# EAGLE design Mother Board (EAGLE 9.6.2)
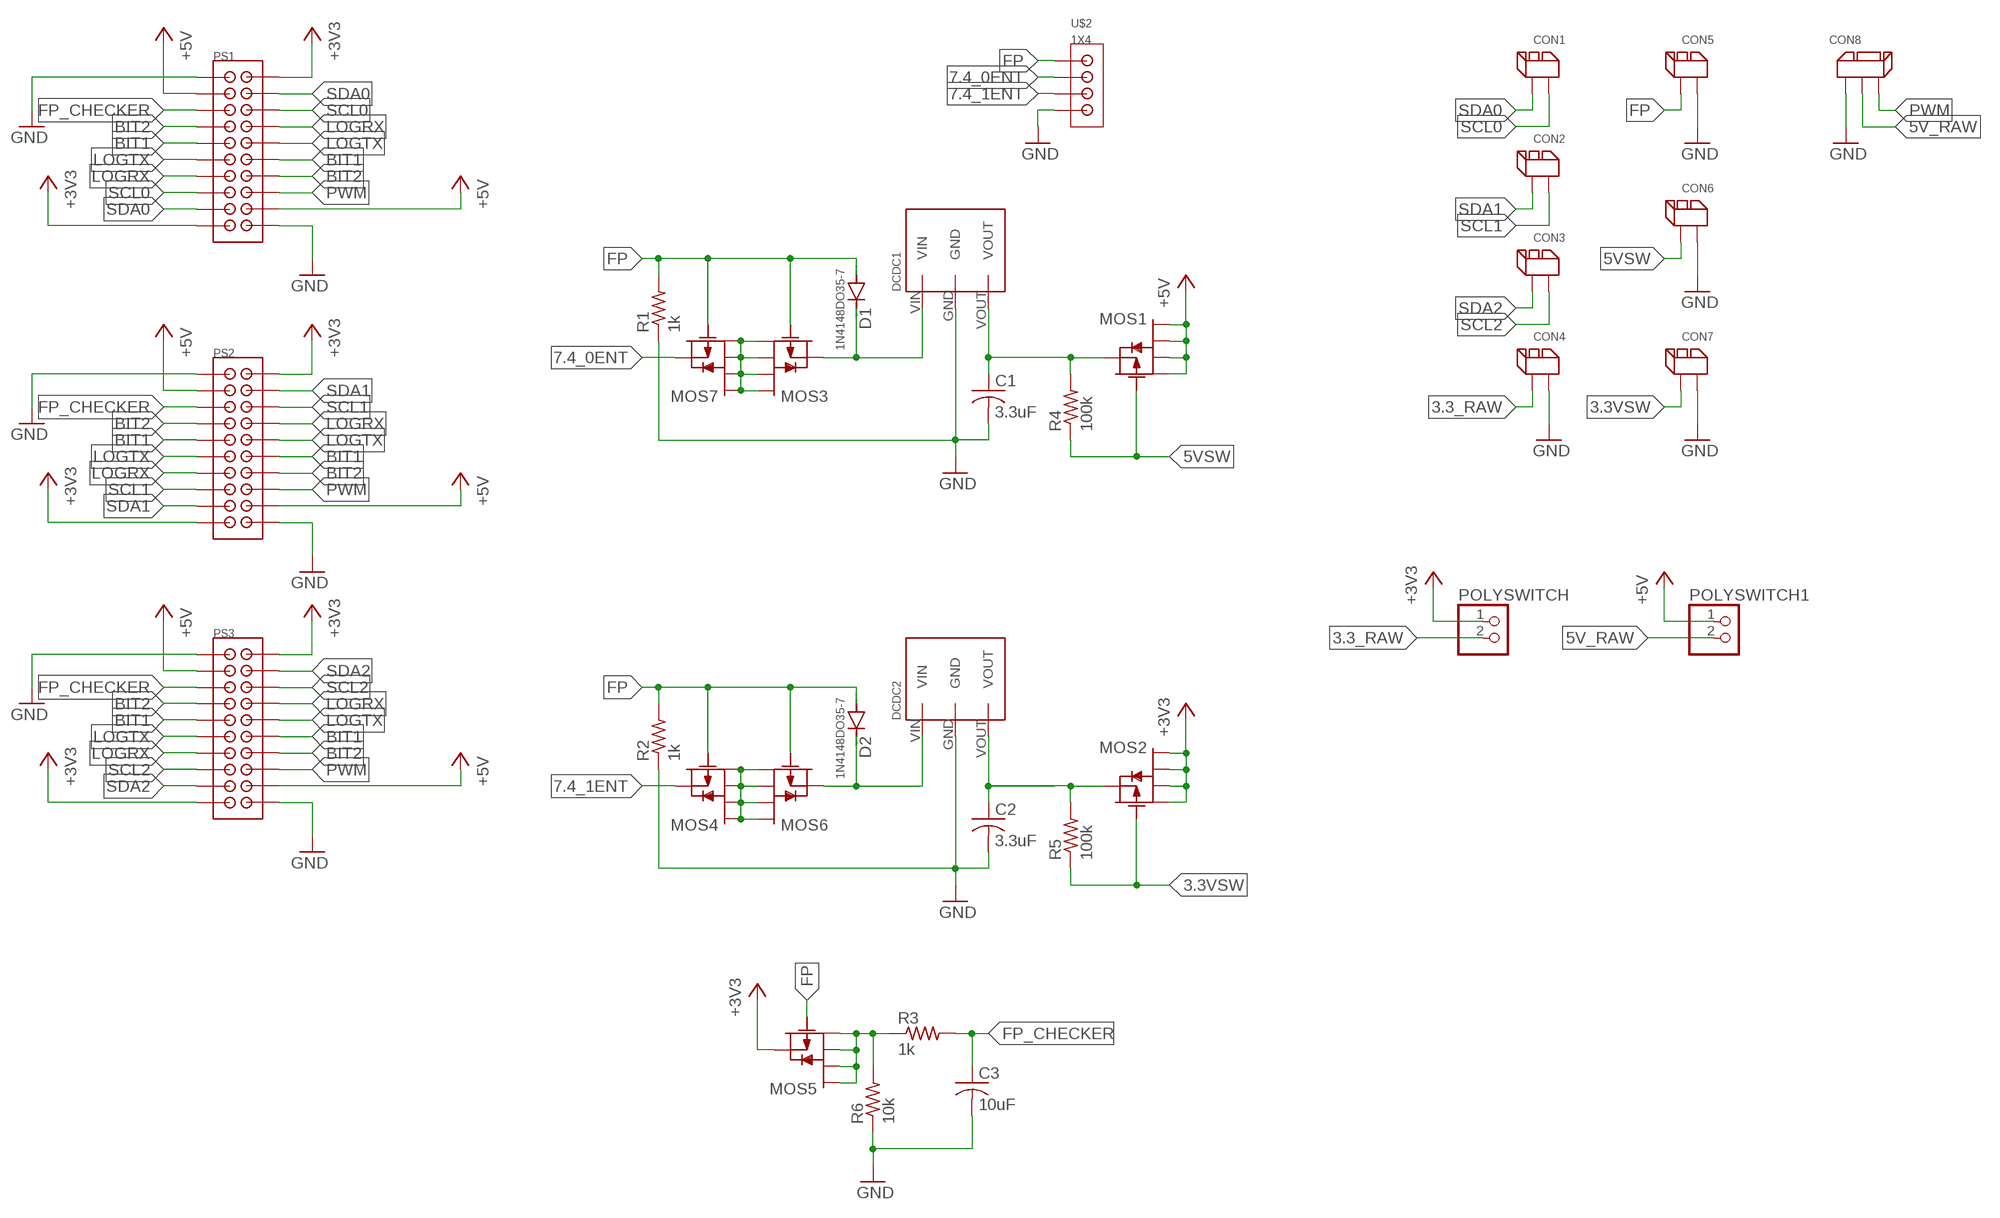
[diagram p0: schematic, sheet 1]

## Parts
C1  3.3uF  C-USC0603  [C0603]
C2  3.3uF  C-USC0603  [C0603]
C3  10uF  C-USC0603  [C0603]
CON1  2PIN  [2PIN]
CON2  2PIN  [2PIN]
CON3  2PIN  [2PIN]
CON4  2PIN  [2PIN]
CON5  2PIN  [2PIN]
CON6  2PIN  [2PIN]
CON7  2PIN  [2PIN]
CON8  3PIN  [3PIN]
D1  1N4148DO35-7  [DO35-7]
D2  1N4148DO35-7  [DO35-7]
DCDC1  5V1A_M78AR05-1  [5V1A_M78AR05-1]
DCDC2  3.3V1A_M78AR033-1  [3.3V1A_M78AR033-1]
MOS1  PCH_SSM6J808R  [SSM6J808R]
MOS2  PCH_SSM6J808R  [SSM6J808R]
MOS3  PCH_SSM6J808R  [SSM6J808R]
MOS4  PCH_SSM6J808R  [SSM6J808R]
MOS5  PCH_SSM6J808R  [SSM6J808R]
MOS6  PCH_SSM6J808R  [SSM6J808R]
MOS7  PCH_SSM6J808R  [SSM6J808R]
POLYSWITCH  PINHD-1X2  [1X02]
POLYSWITCH1  PINHD-1X2  [1X02]
PS1  2X10  [2X10]
PS2  2X10  [2X10]
PS3  2X10  [2X10]
R1  1k  R-US_R0603  [R0603]
R2  1k  R-US_R0603  [R0603]
R3  1k  R-US_R0603  [R0603]
R4  100k  R-US_R0603  [R0603]
R5  100k  R-US_R0603  [R0603]
R6  10k  R-US_R0603  [R0603]
U$2  1X4  [1X4]

## Nets
3.3_RAW: CON4.P$2 POLYSWITCH.2
3.3V_ENT: C2.1 DCDC2.VOUT
3.3VSW: CON7.P$2 MOS2.3 R5.1
5V_ENT: C1.1 DCDC1.VOUT MOS1.4 R4.2
5V_ENT1: MOS2.4 R5.2
5V_RAW: CON8.P$2 POLYSWITCH1.2
5VSW: CON6.P$2 MOS1.3 R4.1
7.4_0ENT: MOS7.4 U$2.P$2
7.4_1ENT: MOS4.4 U$2.P$3
+3V3: MOS2.1 MOS2.2 MOS2.5 MOS2.6 MOS5.4 POLYSWITCH.1 PS1.P$2 PS1.P$19 PS2.P$2 PS2.P$19 PS3.P$2 PS3.P$19
+5V: MOS1.1 MOS1.2 MOS1.5 MOS1.6 POLYSWITCH1.1 PS1.P$3 PS1.P$18 PS2.P$3 PS2.P$18 PS3.P$3 PS3.P$18
BIT1: PS1.P$9 PS1.P$12 PS2.P$9 PS2.P$12 PS3.P$9 PS3.P$12
BIT2: PS1.P$7 PS1.P$14 PS2.P$7 PS2.P$14 PS3.P$7 PS3.P$14
FP: CON5.P$2 D1.A D2.A MOS3.3 MOS4.3 MOS5.3 MOS6.3 MOS7.3 R1.2 R2.2 U$2.P$1
FP_CHECKER: C3.1 PS1.P$5 PS2.P$5 PS3.P$5 R3.2
GND: C1.2 C2.2 C3.2 CON4.P$1 CON5.P$1 CON6.P$1 CON7.P$1 CON8.P$1 DCDC1.GND DCDC2.GND PS1.P$1 PS1.P$20 PS2.P$1 PS2.P$20 PS3.P$1 PS3.P$20 R1.1 R2.1 R6.1 U$2.P$4
LOGRX: PS1.P$8 PS1.P$13 PS2.P$8 PS2.P$13 PS3.P$8 PS3.P$13
LOGTX: PS1.P$10 PS1.P$11 PS2.P$10 PS2.P$11 PS3.P$10 PS3.P$11
N$1: D2.C DCDC2.VIN MOS6.4
N$2: MOS4.1 MOS4.2 MOS4.5 MOS4.6 MOS6.1 MOS6.2 MOS6.5 MOS6.6
N$11: D1.C DCDC1.VIN MOS3.4
N$12: MOS3.1 MOS3.2 MOS3.5 MOS3.6 MOS7.1 MOS7.2 MOS7.5 MOS7.6
N$14: MOS5.1 MOS5.2 MOS5.5 MOS5.6 R3.1 R6.2
PWM: CON8.P$3 PS1.P$16 PS2.P$16 PS3.P$16
SCL0: CON1.P$1 PS1.P$6 PS1.P$15
SCL1: CON2.P$1 PS2.P$6 PS2.P$15
SCL2: CON3.P$1 PS3.P$6 PS3.P$15
SDA0: CON1.P$2 PS1.P$4 PS1.P$17
SDA1: CON2.P$2 PS2.P$4 PS2.P$17
SDA2: CON3.P$2 PS3.P$4 PS3.P$17

## Library data of the parts
C1-C3 = rcl:C-US: CAPACITOR, American symbol; SPICEPREFIX: C
CON1-CON7 = XR Connector:2PIN
CON8 = XR Connector:3PIN
D1 D2 = diode:1N4148: DIODE high speed (Philips)
DCDC1 = DC-DC:5V1A_M78AR05-1
DCDC2 = DC-DC:3.3V1A_M78AR033-1
MOS1-MOS7 = Chip MOSFET:PCH_SSM6J808R
POLYSWITCH POLYSWITCH1 = pinhead:PINHD-1X2: PIN HEADER
PS1-PS3 = PinSocket:2X10
R1-R6 = rcl:R-US_: RESISTOR, American symbol; SPICEPREFIX: R
U$2 = PinSocket:1X4

## Net classes
1 esp: width 0.254 mm, drill 0.127 mm, clearance 0.025 mm

## Board
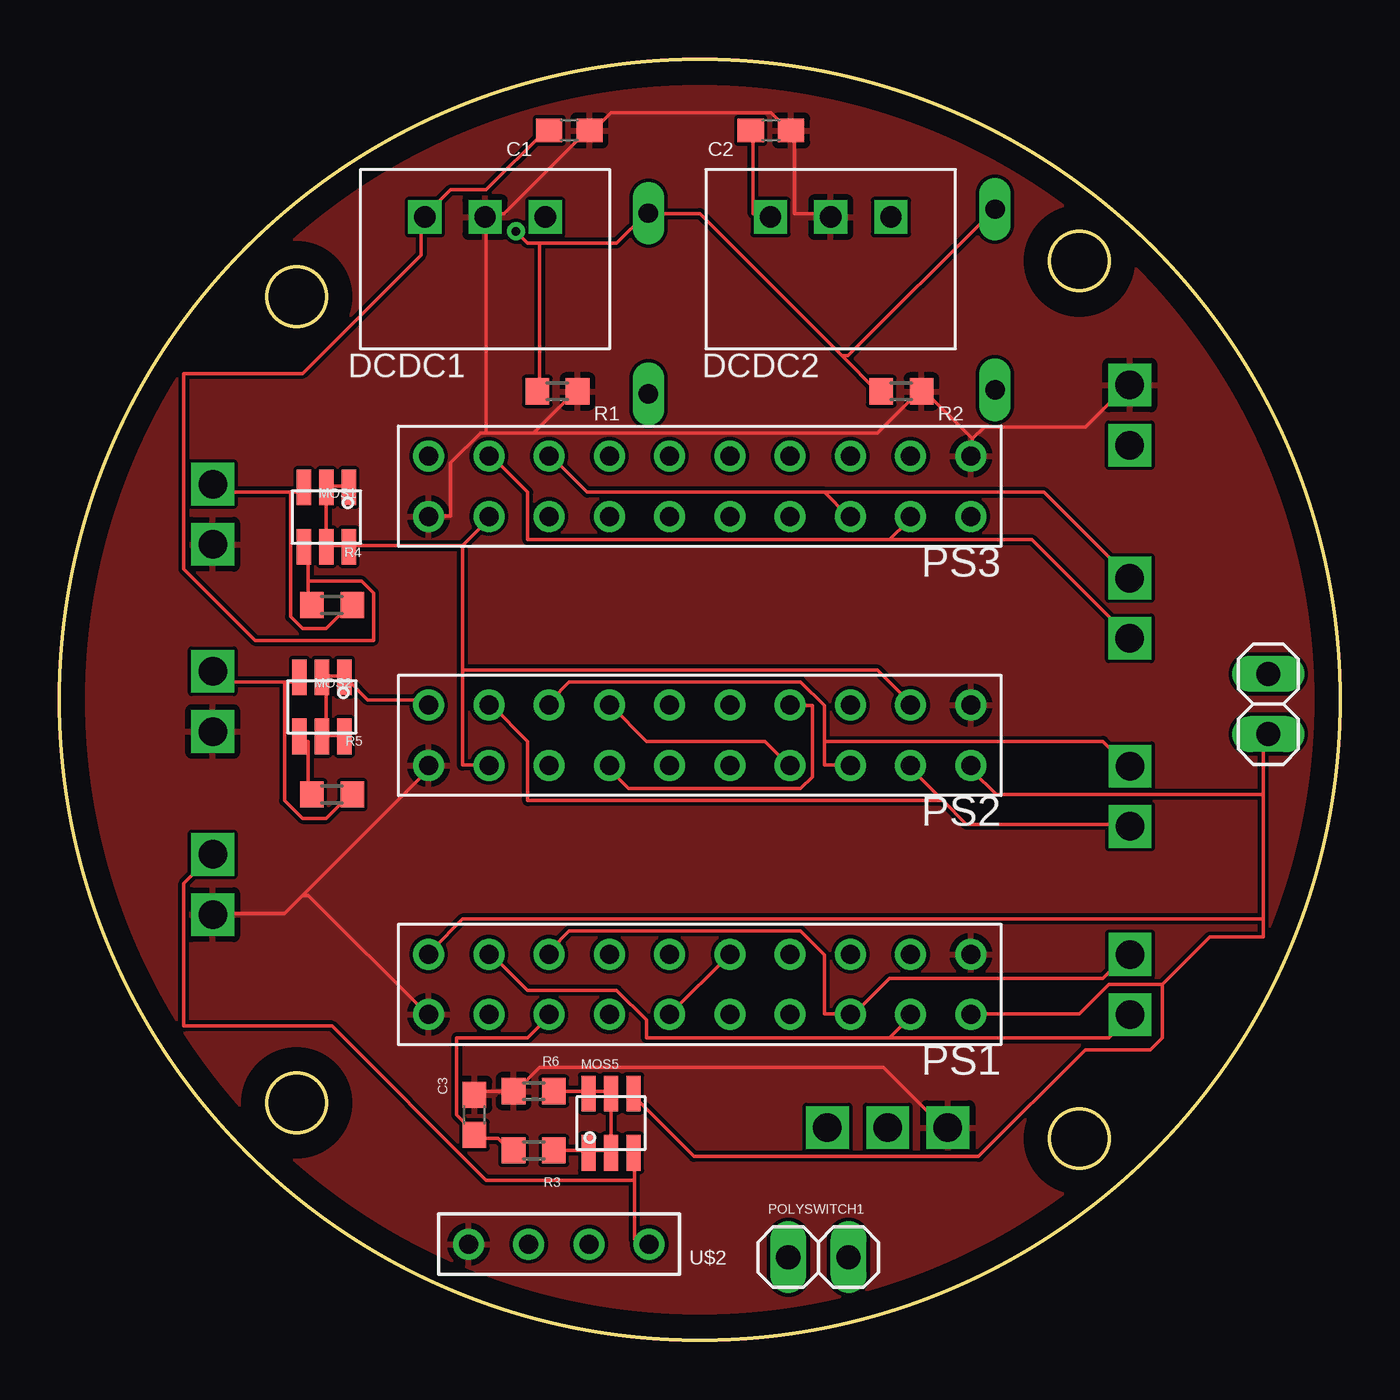
[diagram p1: board, top side]
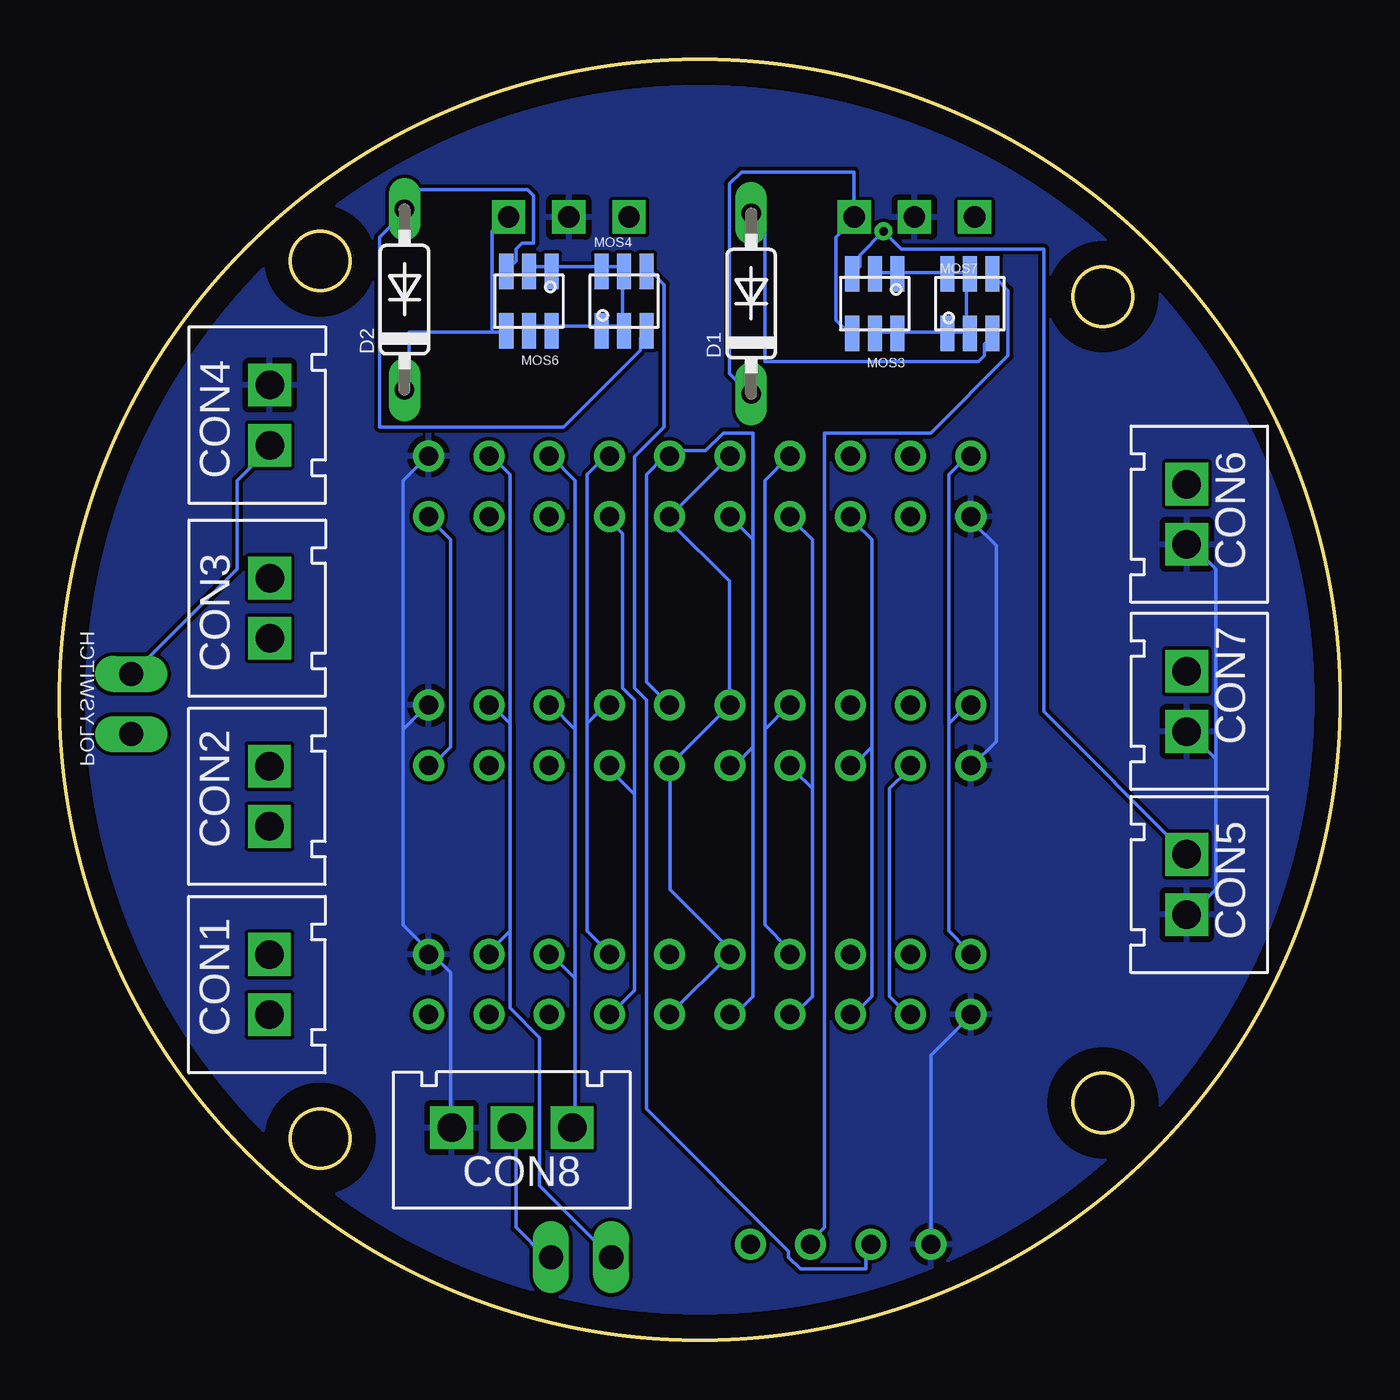
[diagram p2: board, bottom side, seen from below]

Size 54 x 54 mm. Coordinates in mm from the lower left corner, seen from the top.
Outline: circle at 27,27 radius 27
Outline: circle at 10,44 radius 1.25
Outline: circle at 10,10 radius 1.25
Outline: circle at 43,45.5 radius 1.25
Outline: circle at 43,8.5 radius 1.25
Copper layers (1*16): Top 0.035mm / dielectric 1.5mm / Bottom 0.035mm
Design rules "default": minimum track width 6mil, minimum drill 0.35mm, track to track 6mil, track to pad 6mil, pad to pad 6mil, via to via 6mil, smd to smd 6mil, copper to edge 40mil, drill to drill 6mil, minimum pad ring 10mil, minimum via ring 8mil, stop-mask expansion 4mil, vias tented up to drill 0mil, thermal gap 10mil

### Footprints (pad centres in the part's own frame; a part is rotated, then mirrored left to right if it is on the bottom)
C0603 = smd 1.1 x 1: 1 -0.85,0; 2 0.85,0
2PIN = drill 1.2 square: P$1 -1.27,0; P$2 1.27,0
3PIN = drill 1.2 square: P$1 2.54,-2.54; P$2 5.08,-2.54; P$3 7.62,-2.54
DO35-7 = drill 0.813 long: A 3.81,0; C -3.81,0
5V1A_M78AR05-1 = drill 0.9 pad 1.27 square: GND 0,0; VIN 2.54,0; VOUT -2.54,0
3.3V1A_M78AR033-1 = drill 0.9 pad 1.27 square: GND 0,0; VIN 2.54,0; VOUT -2.54,0
SSM6J808R = smd 0.6 x 1.5: 1 -0.95,-1.25; 2 0,-1.25; 3 0.95,-1.25; 4 0.95,1.25; 5 0,1.25; 6 -0.95,1.25
1X02 = drill 1.016 long: 1 -1.27,0; 2 1.27,0
2X10 = drill 0.8: P$1 0,1.27; P$2 0,-1.27; P$3 -2.54,1.27; P$4 -2.54,-1.27; P$5 -5.08,1.27; P$6 -5.08,-1.27; P$7 -7.62,1.27; P$8 -7.62,-1.27; P$9 -10.16,1.27; P$10 -10.16,-1.27; P$11 -12.7,1.27; P$12 -12.7,-1.27; P$13 -15.24,1.27; P$14 -15.24,-1.27; P$15 -17.78,1.27; P$16 -17.78,-1.27; P$17 -20.32,1.27; P$18 -20.32,-1.27; P$19 -22.86,1.27; P$20 -22.86,-1.27
R0603 = smd 1 x 1.1: 1 -0.85,0; 2 0.85,0
1X4 = drill 0.8: P$1 0,0; P$2 2.54,0; P$3 5.08,0; P$4 7.62,0

### Placement (x,y rotation side)
C1  21.5,51 0 top
C2  30,51 0 top
C3  17.5,9.5 90 top
CON1  45.14,14.99 270 bottom
CON2  45.14,22.93 270 bottom
CON3  45.13,30.86 270 bottom
CON4  45.13,39 270 bottom
CON5  6.47,19.21 90 bottom
CON6  6.47,34.82 90 bottom
CON7  6.47,26.93 90 bottom
CON8  40,11.5 0 bottom
D1  24.83,43.7 90 bottom
D2  39.45,43.87 90 bottom
DCDC1  17.95,47.35 0 top
DCDC2  32.52,47.35 0 top
MOS1  11.26,34.7 180 top
MOS2  11.07,26.7 180 top
MOS3  19.62,43.7 180 bottom
MOS4  30.19,43.8 0 bottom
MOS5  23.26,9.15 0 top
MOS6  34.2,43.8 180 bottom
MOS7  15.61,43.7 0 bottom
POLYSWITCH  50.97,26.82 90 top
POLYSWITCH1  32,3.5 0 top
PS1  15.57,15 180 top
PS2  15.57,25.5 180 top
PS3  15.57,36 180 top
R1  21,40 180 top
R2  35.5,40 180 top
R3  20,8 180 top
R4  11.5,31 180 top
R5  11.5,23 180 top
R6  20,10.5 0 top
U$2  24.87,4.05 180 top

### Tracks (layer width: path | path; a pad name or v marks a point on that pad's centre or on a via)
3.3_RAW
  Bottom 0.152: POLYSWITCH.2 50.75,28.25 46.5,32.5 46.5,36.25 45.25,37.5 CON4.P$2
3.3V_ENT
  Top 0.152: C2.1 29.25,51 29.25,47.5 29.75,47.5 DCDC2.VOUT
3.3VSW
  Top 0.152: 9.5,27.75 9.5,22.75 10.25,22 11.25,22 12.25,23 R5.1 | 9.5,27.75 10,27.75 MOS2.3 | 9.5,27.75 6.75,27.75 6.5,28 CON7.P$2
5V_ENT
  Top 0.152: 10.5,32 10.5,33.25 MOS1.4 | 10.5,32 10.5,31 R4.2 | C1.1 20.5,51 18,48.5 16.5,48.5 15.5,47.5 DCDC1.VOUT 15.25,47.25 15.25,45.75 10.25,40.75 5.25,40.75 5.25,32.5 8.25,29.5 13.25,29.5 13.25,31.5 12.75,32 10.5,32
5V_ENT1
  Top 0.152: R5.2 10.5,23 10.5,25.25 10.25,25.25 MOS2.4
5V_RAW  (via drill 0.35)
  Top 0.152: v33.5,3.5 POLYSWITCH1.2
  Bottom 0.152: v33.5,3.5 34.75,4.75 34.75,8.75 CON8.P$2
5VSW
  Top 0.152: 9.75,35.75 9.75,30.5 10.25,30 11.25,30 12.25,31 R4.1 | 9.75,35.75 10.25,35.75 MOS1.3 | 9.75,35.75 6.75,35.75 6.5,36 CON6.P$2
7.4_0ENT
  Bottom 0.152: MOS7.4 14.5,44.75 14,44.25 14,41.5 17.25,38.25 21.75,38.25 21.75,4.75 22.25,4.25 U$2.P$2
7.4_1ENT
  Bottom 0.152: MOS4.4 29,45 28.5,44.5 28.5,38.5 29.75,37.25 29.75,27.5 29.25,27 29.25,9.75 23.25,3.75 23.25,3.5 22.75,3 20,3 20,4 U$2.P$3
+3V3
  Top 0.152: 11.25,25.5 12,25.5 MOS2.6 | 11.25,25.5 11.25,27.75 MOS2.2 11.25,28 12,28 MOS2.1 12.25,27.75 13,27 15.5,27 PS2.P$2 | 11.25,25.5 MOS2.5 | 46.5,15 46.5,12.75 46,12.25 43.25,12.25 38.75,7.75 26.75,7.75 24.25,10.25 MOS5.4 | 46.5,15 44.25,15 43,13.75 38.5,13.75 PS1.P$19 | 50.75,17.75 50.75,17 48.5,17 46.5,15 | 50.75,17.75 50.75,23 | 50.75,23 50.75,25.5 POLYSWITCH.1 | 50.75,23 39.5,23 38.5,24 PS2.P$19 | 50.75,17.75 17,17.75 15.75,16.5 PS1.P$2
  Bottom 0.152: 16.5,26 16.5,17.25 15.75,16.5 PS1.P$2 | 16.5,26 15.75,26.75 PS2.P$2 | 16.5,26 16.5,36.5 15.75,37.25 PS3.P$2 | PS2.P$19 38.25,24.25 37.5,25 37.5,33.75 38.25,34.5 PS3.P$19
+5V  (via drill 0.35)
  Top 0.152: MOS1.1 12,36 11.5,36 MOS1.2 11.25,35.75 11.25,33.5 MOS1.5 11.5,33.5 12,33.5 MOS1.6 12.25,33.5 17,33.5 | 17,33.5 18,34.5 PS3.P$3 | 17,28.25 17,24.25 18,24.25 PS2.P$3 | 17,28.25 17,33.5 | v30.75,3.5 POLYSWITCH1.1 | 17,28.25 34.5,28.25 35.75,27 PS2.P$18
  Bottom 0.152: PS1.P$3 18.25,13.75 19,14.5 19,23.25 18.25,24 PS2.P$3 | 35,17.25 35.75,16.5 PS1.P$18 | 35,26 35,17.25 | 35,26 35.75,26.75 PS2.P$18 | 35,26 35,36.5 35.75,37.25 PS3.P$18 | v30.75,3.5 33.75,6.5 33.75,12.75 35,14 35,17.25
BIT1
  Top 0.152: PS1.P$12 PS1.P$9
  Bottom 0.152: PS2.P$12 29.25,27.75 29.25,36.5 28.5,37.25 PS3.P$12 28.25,37.5 26.75,37.5 26,38.25 24.75,38.25 24.75,33.75 | 24.75,25 25.5,24.25 PS2.P$9 | 24.75,33.75 24.75,25 | PS3.P$9 24.75,33.75 | 24.75,25 24.75,14.5 25.5,13.75 PS1.P$9
BIT2
  Top 0.152: PS2.P$7 23.25,24 24,23.25 31.25,23.25 31.75,23.75 31.75,26.75 31,26.75 PS2.P$14
  Bottom 0.152: 22.25,23.25 22.25,14.5 23,13.75 PS1.P$7 | 22.25,23.25 23,24 PS2.P$7 | 22.25,23.25 22.25,33.75 23,34.5 PS3.P$7 | 31.75,26 31.75,17.25 31,16.5 PS1.P$14 | 31.75,26 31,26.75 PS2.P$14 | 31.75,26 31.75,36.5 31,37.25 PS3.P$14
FP  (via drill 0.35)
  Top 0.152: 20.25,46.25 20.25,40 R1.2 | 20.25,46.25 23.5,46.25 24.75,47.5 D1.A 25,47.5 27,47.5 33,41.5 | 33,41.5 34.5,40 R2.2 | v19.25,46.75 19.75,46.25 20.25,46.25 | 33,41.5 33.25,41.5 39.25,47.5 D2.A | 24.25,6.75 24.25,4.25 24.75,4.25 U$2.P$1 | 24.25,6.75 24.25,7.75 MOS5.3 | 24.25,6.75 18,6.75 11.5,13.25 5.25,13.25 5.25,19.25 6.25,20.25 CON5.P$2
  Bottom 0.152: MOS4.3 29.25,42.5 29.5,42.25 29.5,41.75 32.75,38.5 40.5,38.5 40.5,46.5 39.5,47.5 D2.A 39.25,47.75 39.25,48.5 34.25,48.5 34,48.25 34,46.25 34.5,46.25 34.75,46 34.75,45.5 35,45.25 MOS6.3 | MOS7.3 14.75,42.25 15,42 15,41.5 15.25,41.25 24.25,41.25 24.25,47 24.75,47.5 D1.A | MOS3.3 20.5,45 20.25,45.25 20.25,45.75 v19.25,46.75 18.5,46 12.5,46 12.5,26.5 6.5,20.5 CON5.P$2
FP_CHECKER
  Top 0.152: R3.2 19,8 18.5,8.5 17.5,8.5 C3.1 17.5,8.75 16.75,9.5 16.75,12.75 19.75,12.75 20.5,13.5 PS1.P$5
  Bottom 0.152: 19.75,25 20.5,24.25 PS2.P$5 | 19.75,25 19.75,33.75 20.5,34.5 PS3.P$5 | 19.75,25 19.75,14.5 20.5,13.75 PS1.P$5
GND
  Top 0.152: 38.5,38 36.5,40 R2.1 36.25,40 34.5,38.25 20,38.25 | 38.5,38 38.5,37.5 PS3.P$20 | 38.5,38 39,38.5 43.25,38.5 45,40.25 CON4.P$1 | C3.2 17.5,10.5 R6.1 19.25,10.5 20.25,11.5 34.75,11.5 37.25,9 CON8.P$1 | 20,38.25 21.75,40 R1.1 | 18,38.25 17.75,38.25 16.5,37 16.5,34.75 15.75,34.75 PS3.P$1 | 18,38.25 20,38.25 | DCDC2.GND 32.5,47.5 31,47.5 31,51 C2.2 30.75,51 30,51.75 23.25,51.75 22.5,51 C1.2 22.25,51 18.75,47.5 18,47.5 DCDC1.GND 18,47.25 18,38.25 | 10.25,18.75 9.5,18 6.5,18 CON5.P$1 | 10.25,18.75 15.5,24 PS2.P$1 | 10.25,18.75 10.5,18.75 15.5,13.75 PS1.P$1
  Bottom 0.152: CON8.P$1 37.5,9 37.5,15.5 38.25,16.25 PS1.P$20 38.5,16.5 39.5,17.5 39.5,25.75 | 39.5,25.75 38.5,26.75 PS2.P$20 | 39.5,25.75 39.5,36.25 38.5,37.25 PS3.P$20 | U$2.P$4 17.25,12 15.75,13.5 PS1.P$1 | 5.25,24.5 6.25,25.5 CON7.P$1 | 5.25,24.5 5.25,19 6.25,18 CON5.P$1 | 5.25,24.5 5.25,32.5 6.25,33.5 CON6.P$1 | PS3.P$1 15.5,34.5 14.5,33.5 14.5,25.25 15.5,24.25 PS2.P$1
  pour Top: -2.5,58 56.5,58 56.5,-3.5 -2.5,-3.5
  pour Bottom: -2.5,58 56.5,58 56.5,-4 -2.5,-4
LOGRX
  Top 0.152: PS2.P$8 23.25,26.75 24.75,25.25 29.75,25.25 30.75,24.25 PS2.P$13
  Bottom 0.152: 24.25,25.75 24.25,17.5 23.25,16.5 PS1.P$8 | 24.25,25.75 23.25,26.75 PS2.P$8 | 24.25,25.75 24.25,36.25 23.25,37.25 PS3.P$8 | 29.75,23 29.75,14.75 30.75,13.75 PS1.P$13 | 29.75,23 30.75,24 PS2.P$13 | 29.75,23 29.75,27 30.25,27.5 30.25,34 30.75,34.5 PS3.P$13
LOGTX
  Bottom 0.152: PS3.P$10 PS3.P$11 28.25,34.5 25.75,32 25.75,27 PS2.P$10 PS2.P$11 28.25,24 28.25,19 25.75,16.5 PS1.P$10 PS1.P$11
N$1
  Bottom 0.152: 35.75,42.5 39.25,42.5 39.25,40.25 D2.C | 35.75,42.5 35.25,42.5 MOS6.4 | 35.75,42.5 35.75,46.75 35.25,47.25 DCDC2.VIN
N$2
  Bottom 0.152: 30.25,42.75 31,42.75 MOS4.1 31.25,42.75 33.25,42.75 | 33.25,42.75 34,42.75 MOS6.5 | 33.25,42.75 MOS6.6 | 33.25,45.25 34,45.25 MOS6.2 | 33.25,45.25 31.25,45.25 MOS4.6 31,45.25 30.25,45.25 MOS4.5 30.25,45 30.25,42.75 | 33.25,45.25 MOS6.1 | 30.25,42.75 MOS4.2
N$11
  Bottom 0.152: MOS3.4 20.75,42.5 21.25,43 21.25,46.5 20.5,47.25 DCDC1.VIN 20.5,47.5 20.5,49.25 25.25,49.25 25.75,48.75 25.75,40.75 25,40 D1.C
N$12
  Bottom 0.152: 15.75,42.5 16.5,42.5 MOS7.1 16.75,42.5 18.5,42.5 MOS3.6 18.75,42.5 19.5,42.5 MOS3.5 | MOS3.2 19.5,45 18.75,45 MOS3.1 18.5,45 16.75,45 MOS7.6 16.5,45 15.75,45 MOS7.5 15.75,44.75 15.75,42.5 | 15.75,42.5 MOS7.2
N$14
  Top 0.152: R3.1 22.25,8 MOS5.1 22.5,8 23.25,8 | R6.2 22.25,10.5 MOS5.6 22.5,10.5 23.25,10.5 MOS5.5 23.25,10.25 23.25,8 | 23.25,8 MOS5.2
PWM
  Bottom 0.152: 32.25,15.25 33.25,16.25 PS1.P$16 | 32.25,15.25 32.25,9 CON8.P$3 | 32.25,25.75 33.25,26.75 PS2.P$16 | 32.25,15.25 32.25,25.75 | 32.25,25.75 32.25,36.25 33.25,37.25 PS3.P$16
SCL0
  Top 0.152: CON1.P$1 45,16.25 44,15.25 35,15.25 33.5,13.75 PS1.P$15 33.25,13.75 32.25,13.75 32.25,16.25 31.25,17.25 21.5,17.25 20.75,16.5 PS1.P$6
SCL1
  Top 0.152: 32.25,25.25 32.25,24.25 33.25,24.25 PS2.P$15 | 32.25,25.25 32.25,26.75 31.25,27.75 21.5,27.75 20.75,27 PS2.P$6 | 32.25,25.25 44,25.25 45,24.25 CON2.P$1
SCL2
  Top 0.152: 32.25,35.75 22.25,35.75 20.75,37.25 PS3.P$6 | 32.25,35.75 33.25,34.75 PS3.P$15 | 32.25,35.75 41.5,35.75 45,32.25 CON3.P$1
SDA0
  Top 0.152: 35,12.75 24.75,12.75 24.75,13.5 23.5,14.75 19.75,14.75 18.25,16.25 PS1.P$4 | 35,12.75 35.75,13.5 PS1.P$17 | 35,12.75 44.25,12.75 45,13.5 CON1.P$2
SDA1
  Top 0.152: 37.25,22.75 38.25,21.75 45,21.75 CON2.P$2 | 37.25,22.75 36,24 PS2.P$17 | 37.25,22.75 19.75,22.75 19.75,25.25 18.25,26.75 PS2.P$4
SDA2
  Top 0.152: 35,33.75 19.75,33.75 19.75,35.75 18.25,37.25 PS3.P$4 | 35,33.75 35.75,34.5 PS3.P$17 | 35,33.75 41,33.75 45,29.75 CON3.P$2